# EAGLE schematic gps_front_end_v1 (EAGLE 7.5.0)
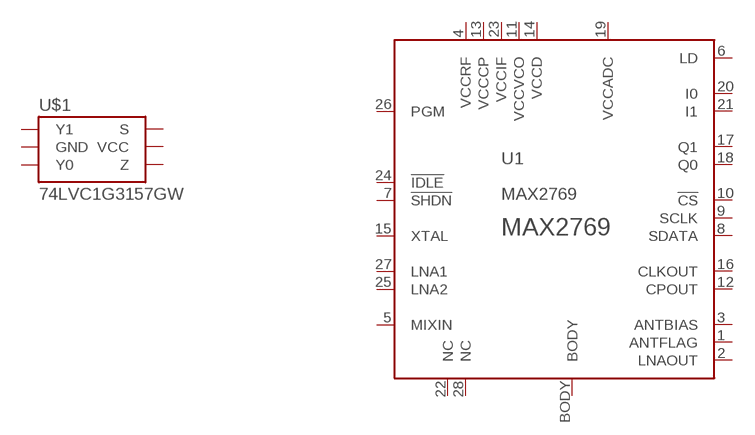
[diagram p0: schematic, sheet 1]

## Parts
U1  MAX2769  [90-0023]
U$1  74LVC1G3157GW  [SOT363]
Unconnected: U1.1(ANTFLAG) U1.2(LNAOUT) U1.3(ANTBIAS) U1.5(MIXIN) U1.6(LD) U1.7(!SHDN) U1.8(SDATA) U1.9(SCLK) U1.10(!CS) U1.12(CPOUT) U1.15(XTAL) U1.16(CLKOUT) U1.17(Q1) U1.18(Q0) U1.20(I0) U1.21(I1) U1.22(NC) U1.24(!IDLE) U1.25(LNA2) U1.26(PGM) U1.27(LNA1) U1.28(NC) U$1.1(Y1) U$1.3(Y0) U$1.4(Z) U$1.6(S)

## Power pins joined to a net without a drawn wire
BODY: U1.BODY
GND: U$1.2(GND)
VCC: U$1.5(VCC)
VCCADC: U1.19(VCCADC)
VCCCP: U1.13(VCCCP)
VCCD: U1.14(VCCD)
VCCIF: U1.23(VCCIF)
VCCRF: U1.4(VCCRF)
VCCVCO: U1.11(VCCVCO)

## Library data of the parts
U1 = wicker:MAX2769: MAX2769 Universal GPS Receiver IC Package Land Pattern [T2855-3/T2855-3+] http://pdfserv.maxim-ic.com/land_patterns/90-0023.PDF Thin Quad Flatpack, No Leads http://pdfserv.maxim-ic.com/package_dwgs/21-0140.PDF Related Datasheet http://www.maxim-ic.com/datasheet/index.mvp/id/5241
U$1 = wicker:74LVC1G3157GW: Not proven.